# Altium schematic sheet 三闪灯.SchDoc
size A4
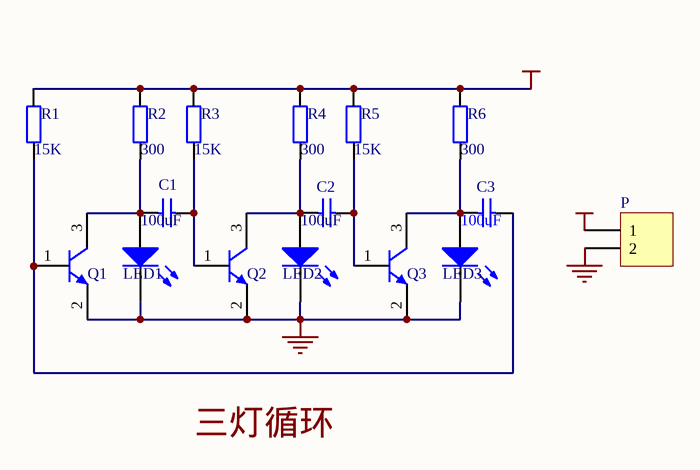
[diagram p0: 三闪灯.SchDoc]

## Parts
C1  value 100uF  [DJDR_5mm]  (hidden comment: Cap)
C2  value 100uF  [DJDR_5mm]  (hidden comment: Cap)
C3  value 100uF  [DJDR_5mm]  (hidden comment: Cap)
LED1  LED2  [LED]  (value not drawn)
LED2  LED2  [LED]  (value not drawn)
LED3  LED2  [LED]  (value not drawn)
P  Header 2H  [HDR-2]  (value not drawn)
Q1  2N3904  [SANJG]  (value not drawn)
Q2  2N3904  [SANJG]  (value not drawn)
Q3  2N3904  [SANJG]  (value not drawn)
R1  value 15K  [RSE]  (hidden comment: Res2)
R2  value 300  [RSE]  (hidden comment: Res2)
R3  value 15K  [RSE]  (hidden comment: Res2)
R4  value 300  [RSE]  (hidden comment: Res2)
R5  value 15K  [RSE]  (hidden comment: Res2)
R6  value 300  [RSE]  (hidden comment: Res2)

## Nets
GND: LED1.2(K) LED2.2(K) LED3.2(K) P.2 Q1.2(E) Q2.2(E) Q3.2(E)
VCC: P.1 R1.2 R2.2 R3.2 R4.2 R5.2 R6.2
NetC1_1: C1.1 LED1.1(A) Q1.3(C) R2.1
NetC1_2: C1.2 Q2.1(B) R3.1
NetC2_1: C2.1 LED2.1(A) Q2.3(C) R4.1
NetC2_2: C2.2 Q3.1(B) R5.1
NetC3_1: C3.1 LED3.1(A) Q3.3(C) R6.1
NetC3_2: C3.2 Q1.1(B) R1.1

## Notes on the sheet
- Labels drawn without touching a wire or pin: 三灯循环

## Library data of the parts
C1-C3 = Cap: Capacitor; Published: 8-Jun-2000; LatestRevisionDate: 17-Jul-2002; LatestRevisionNote: Re-released for DXP Platform.; Publisher: Altium Limited
LED1-LED3 = LED2: Typical RED, GREEN, YELLOW, AMBER GaAs LED; Published: 8-Jun-2000; LatestRevisionDate: 17-Jul-2002; LatestRevisionNote: Re-released for DXP Platform.; Publisher: Altium Limited
P = Header 2H: Header, 2-Pin, Right Angle; LatestRevisionDate: 17-Jul-2002; LatestRevisionNote: Re-released for DXP Platform.; Publisher: Altium Limited
Q1-Q3 = 2N3904: NPN General Purpose Amplifier; Published: 8-Jun-2000; LatestRevisionDate: 15-Jan-2003; LatestRevisionNote: PCB Footprint 'BCY-W3/D4.7' replaced; DatasheetDocument: 1997; PackageReference: TO-92A; Publisher: Altium Limited; Code_JEDEC: TO-92A
R1-R6 = Res2: Resistor; Published: 8-Jun-2000; LatestRevisionDate: 17-Jul-2002; LatestRevisionNote: Re-released for DXP Platform.; Publisher: Altium Limited